# Altium schematic sheet design_13.SchDoc: design
size 414 x 279 mm; Date: 1/25/2021 11:39:22 PM; SheetNumber: 14; Origin: Eagle; GateName_1: G$1; SymbolName_1: A3-L-GUMSTIX; LibraryName: qualified_1; DeviceSetName: A3-L-GUMSTIX; A: A; B: B; C: C; D: D; E: E; F: F; G: G; H: H; 1: 1; 2: 2; 3: 3; 4: 4; 5: 5; Sheet: Sheet:; C:/Gumstix/gumstix-logo-16.bmp: C:/Gumstix/gumstix-logo-16.bmp; Board: Board:
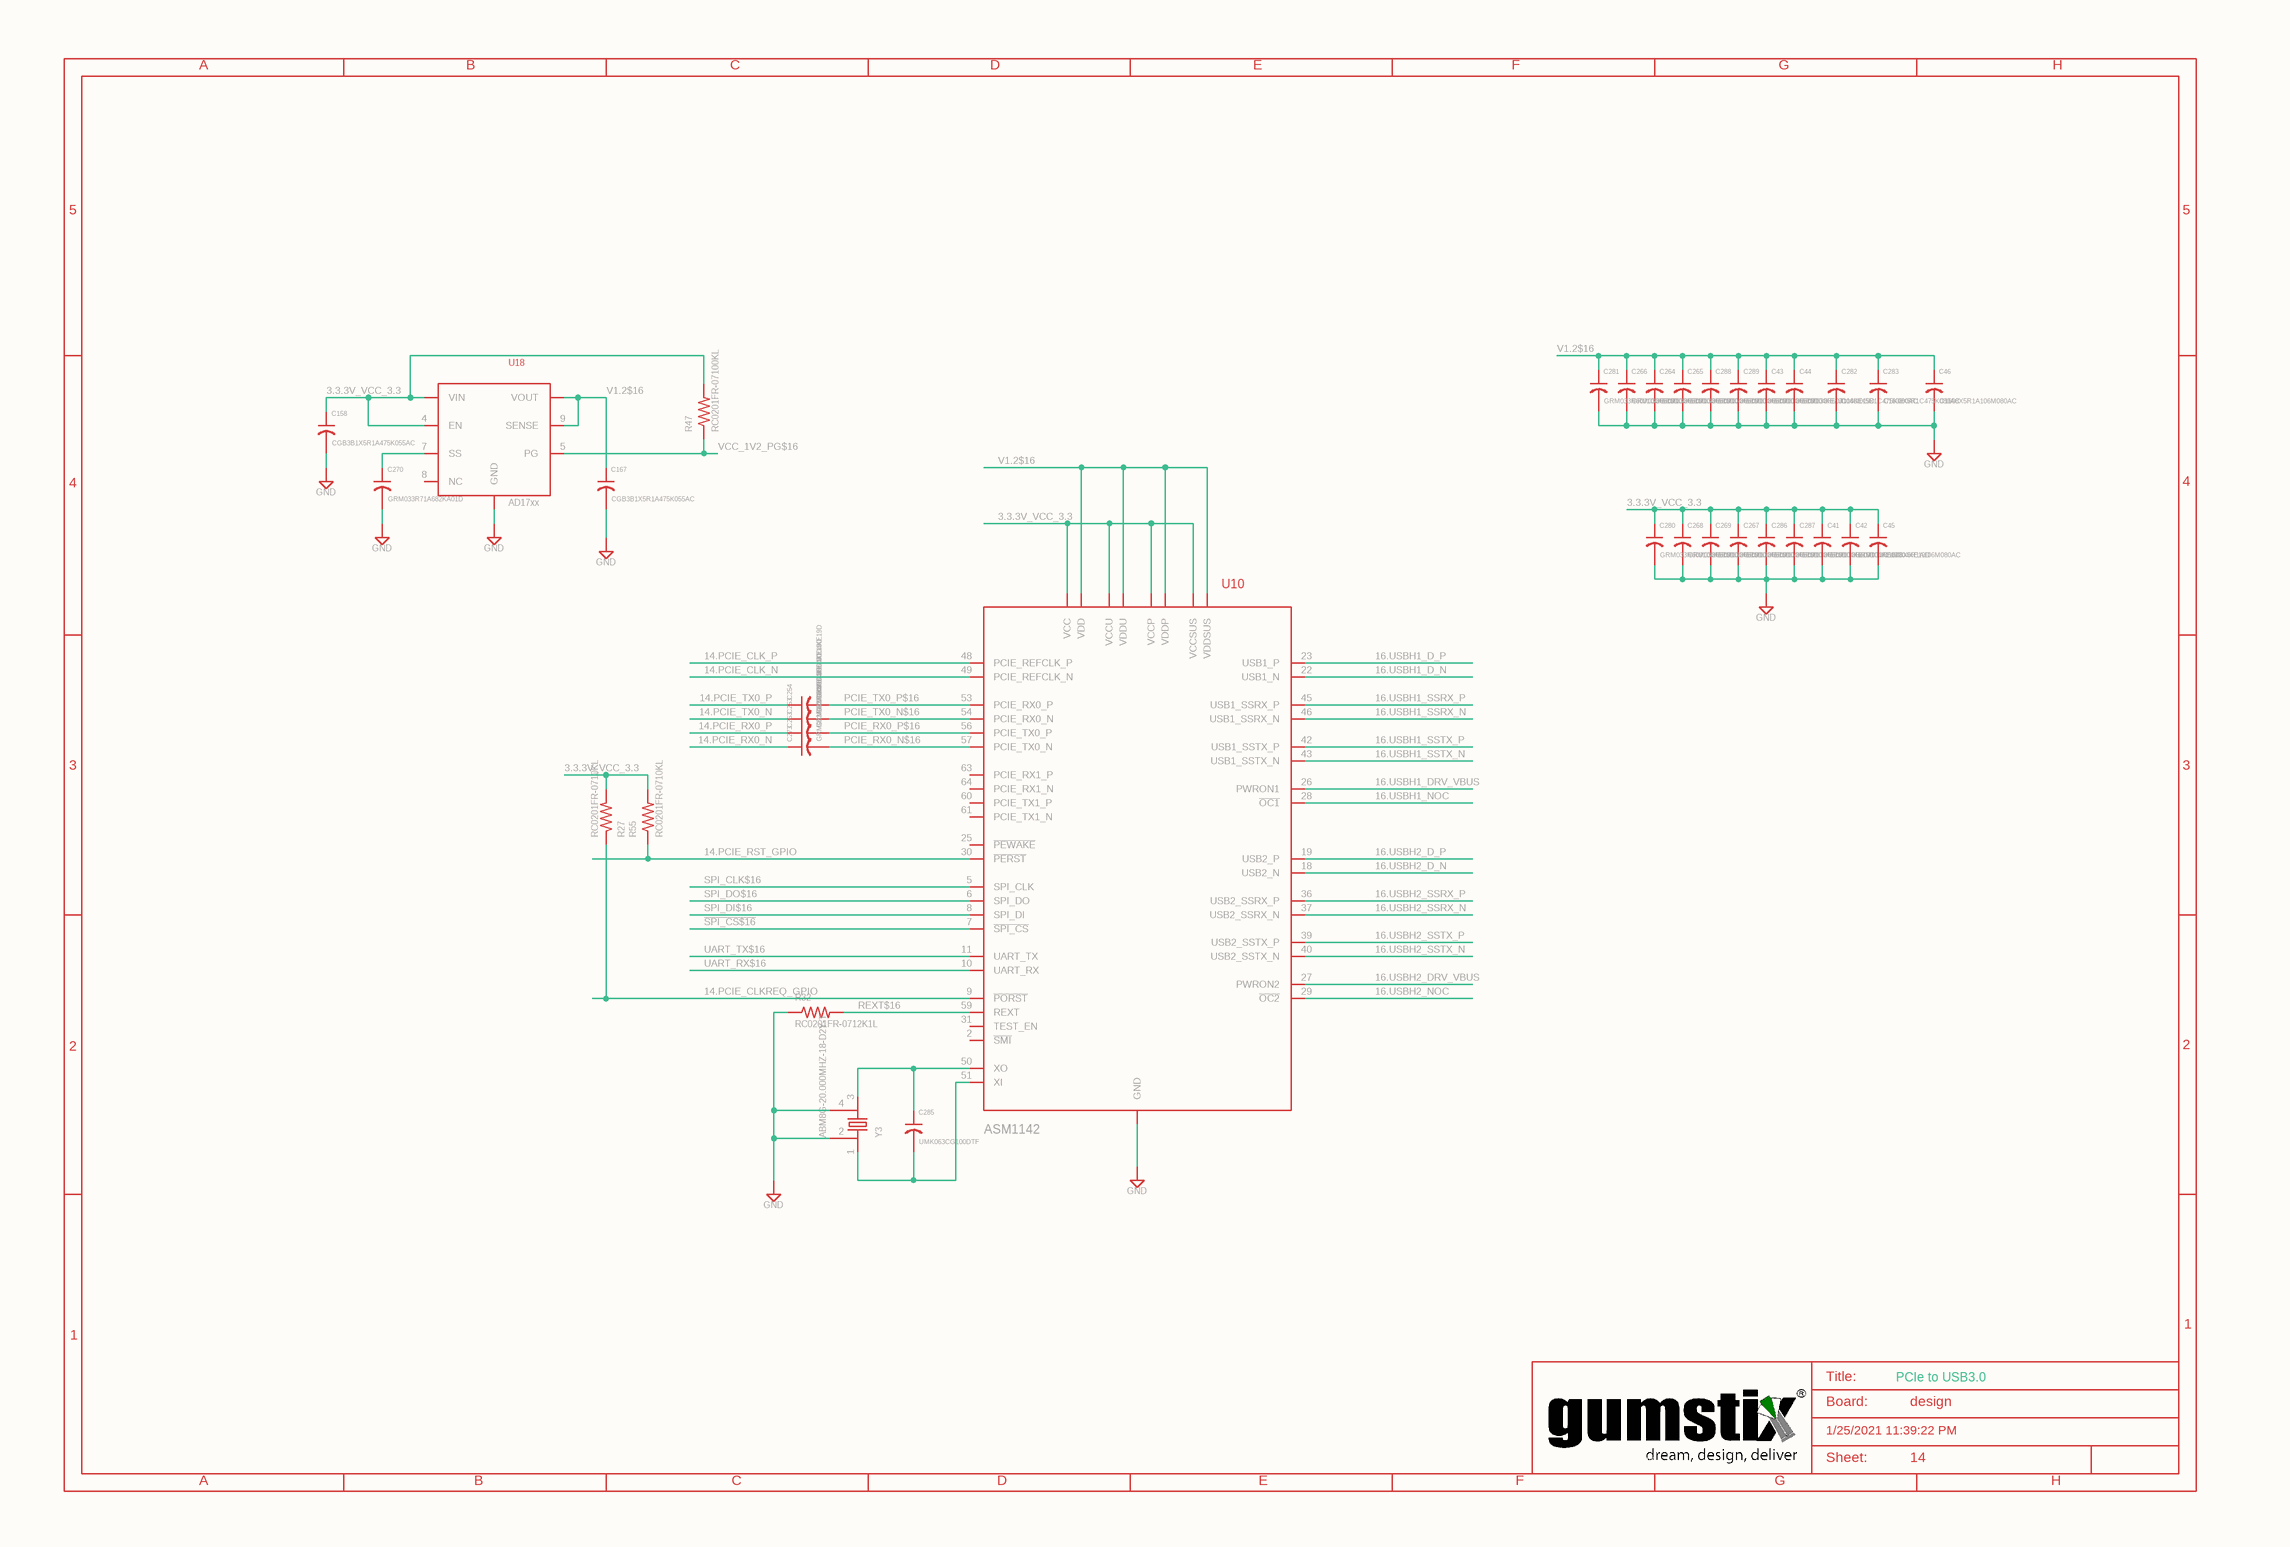
[diagram p0: design_13.SchDoc]

## Parts
C41  GRM033R60J104KE19D  [0201]
C42  GRM033R60J104KE19D  [0201]
C43  GRM033R60J104KE19D  [0201]
C44  GRM033R60J104KE19D  [0201]
C45  C1608X5R1A106M080AC  [0603]
C46  C1608X5R1A106M080AC  [0603]
C158  CGB3B1X5R1A475K055AC  [0603]
C167  CGB3B1X5R1A475K055AC  [0603]
C253  GRM033R60J104KE19D  [0201]
C254  GRM033R60J104KE19D  [0201]
C263  GRM033R60J104KE19D  [0201]
C264  GRM033R60J104KE19D  [0201]
C265  GRM033R60J104KE19D  [0201]
C266  GRM033R60J104KE19D  [0201]
C267  GRM033R60J104KE19D  [0201]
C268  GRM033R60J104KE19D  [0201]
C269  GRM033R60J104KE19D  [0201]
C270  GRM033R71A682KA01D  [0201]
C273  GRM033R60J104KE19D  [0201]
C280  GRM033R60J104KE19D  [0201]
C281  GRM033R60J104KE19D  [0201]
C282  C1608X5R1C475K080AC  [0603]
C283  C1608X5R1C475K080AC  [0603]
C285  UMK063CG100DTF  [0201]
C286  GRM033R60J104KE19D  [0201]
C287  GRM033R60J104KE19D  [0201]
C288  GRM033R60J104KE19D  [0201]
C289  GRM033R60J104KE19D  [0201]
R27  RC0201FR-0710KL  [0201]
R32  RC0201FR-0712K1L  [0201]
R47  RC0201FR-07100KL  [0201]
R55  RC0201FR-0710KL  [0201]
SUPPLY84  GND
SUPPLY87  GND
SUPPLY99  GND
SUPPLY141  GND
SUPPLY162  GND
SUPPLY163  GND
SUPPLY164  GND
SUPPLY165  GND
U10  ASM1142  [QFN64-9X9MM-FT2232HQ]
U18  ADP1740ACPZ-1.2-R7  [LFCSPWQ16]  (value not drawn)
Y3  ABM8G-20.000MHZ-18-D2Y-T  [CRYSTAL-3225]

## Nets
3.3.3V_VCC_3.3: C41.1 C42.1 C45.1 C158.1 C267.1 C268.1 C269.1 C280.1 C286.1 C287.1 R27.2 R47.2 R55.2 U10.4_32(VCC) U10.20_24(VCCSUS) U10.38_44(VCCU) U10.55_62(VCCP) U18.1_2_3_15_16(VIN) U18.4(EN)
14.PCIE_CLK_N: U10.49(PCIE_REFCLK_N)
14.PCIE_CLK_P: U10.48(PCIE_REFCLK_P)
14.PCIE_CLKREQ_GPIO: R27.1 U10.9(~{PORST})
14.PCIE_RST_GPIO: R55.1 U10.30(~{PERST})
14.PCIE_RX0_N: C273.1
14.PCIE_RX0_P: C263.1
14.PCIE_TX0_N: C253.1
14.PCIE_TX0_P: C254.1
16.USBH1_D_N: U10.22(USB1_N)
16.USBH1_D_P: U10.23(USB1_P)
16.USBH1_DRV_VBUS: U10.26(PWRON1)
16.USBH1_NOC: U10.28(~{OC1})
16.USBH1_SSRX_N: U10.46(USB1_SSRX_N)
16.USBH1_SSRX_P: U10.45(USB1_SSRX_P)
16.USBH1_SSTX_N: U10.43(USB1_SSTX_N)
16.USBH1_SSTX_P: U10.42(USB1_SSTX_P)
16.USBH2_D_N: U10.18(USB2_N)
16.USBH2_D_P: U10.19(USB2_P)
16.USBH2_DRV_VBUS: U10.27(PWRON2)
16.USBH2_NOC: U10.29(~{OC2})
16.USBH2_SSRX_N: U10.37(USB2_SSRX_N)
16.USBH2_SSRX_P: U10.36(USB2_SSRX_P)
16.USBH2_SSTX_N: U10.40(USB2_SSTX_N)
16.USBH2_SSTX_P: U10.39(USB2_SSTX_P)
PCIE_RX0_N$16: C273.2 U10.57(PCIE_TX0_N)
PCIE_RX0_P$16: C263.2 U10.56(PCIE_TX0_P)
PCIE_TX0_N$16: C253.2 U10.54(PCIE_RX0_N)
PCIE_TX0_P$16: C254.2 U10.53(PCIE_RX0_P)
REXT$16: R32.2 U10.59(REXT)
~{SPI_CS$16}: U10.7(~{SPI_CS})
SPI_CLK$16: U10.5(SPI_CLK)
SPI_DI$16: U10.8(SPI_DI)
SPI_DO$16: U10.6(SPI_DO)
UART_RX$16: U10.10(UART_RX)
UART_TX$16: U10.11(UART_TX)
V1.2$16: C43.1 C44.1 C46.1 C167.1 C264.1 C265.1 C266.1 C281.1 C282.1 C283.1 C288.1 C289.1 U10.1_12_33(VDD) U10.21_34(VDDSUS) U10.35_41_47(VDDU) U10.52_58(VDDP) U18.9(SENSE) U18.10_11_12_13_14(VOUT)
VCC_1V2_PG$16: R47.1 U18.5(PG)
NetC41_2: C41.2 C42.2 C45.2 C267.2 C268.2 C269.2 C280.2 C286.2 C287.2 SUPPLY164.?1(GND)
NetC43_2: C43.2 C44.2 C46.2 C264.2 C265.2 C266.2 C281.2 C282.2 C283.2 C288.2 C289.2 SUPPLY165.?1(GND)
NetC158_2: C158.2 SUPPLY84.?1(GND)
NetC167_2: C167.2 SUPPLY87.?1(GND)
NetC270_1: C270.1 U18.7(SS)
NetC270_2: C270.2 SUPPLY141.?1(GND)
NetC285_1: C285.1 U10.50(XO) Y3.3
NetC285_2: C285.2 U10.51(XI) Y3.1
NetR32_1: R32.1 SUPPLY163.?1(GND) Y3.2 Y3.4
NetSUPPLY99_?1: SUPPLY99.?1(GND) U18.6_EP_EP1_EP2_EP3_EP4(GND)
NetSUPPLY162_?1: SUPPLY162.?1(GND) U10.15_65_EPAD1_EPAD2_EPAD3_EPAD4_EPAD5_EPAD6_EPAD7_EPAD8_EPAD9_EPAD10_EPAD11_EPAD12(GND)

Not connected (* = marked no-connect by the designer): U10 2(~{SMI}) 25(~{PEWAKE}) 31(TEST_EN) 60(PCIE_TX1_P) 61(PCIE_TX1_N) 63(PCIE_RX1_P) 64(PCIE_RX1_N); U18 8(NC)

## Notes on the sheet
- A
- B
- C
- D
- E
- F
- G
- H
- 5
- 4
- 3
- 2
- 1
- Title:
- Board:
- PCIe to USB3.0
- design
- C:/Gumstix/gumstix-logo-16.bmp
- 1/25/2021 11:39:22 PM
- Sheet:
- 14

## Library data of the parts
C41-C44 C253 C254 C263-C269 C273 C280 C281 C286-C289 = GRM033R60J104KE19D: GateName_1: G$1; SymbolName_1: C-US; LibraryName: qualified_1@eagle_src_repo_701dee95a4f0c9d27f896634bd535ea9ef5a137e; DeviceSetName: GRM033R60J104KE19D; HEIGHT: 0.25
C45 C46 = C1608X5R1A106M080AC: GateName_1: G$1; SymbolName_1: C-US; LibraryName: qualified_1@eagle_src_repo_701dee95a4f0c9d27f896634bd535ea9ef5a137e; DeviceSetName: C1608X5R1A106M080AC; HEIGHT: 0.5
C158 C167 = CGB3B1X5R1A475K055AC: GateName_1: G$1; SymbolName_1: C-US; LibraryName: qualified_1@eagle_src_repo_701dee95a4f0c9d27f896634bd535ea9ef5a137e; DeviceSetName: CGB3B1X5R1A475K055AC; HEIGHT: 0.5
C270 = GRM033R71A682KA01D: GateName_1: G$1; SymbolName_1: C-US; LibraryName: qualified_1@eagle_src_repo_701dee95a4f0c9d27f896634bd535ea9ef5a137e; DeviceSetName: GRM033R71A682KA01D; HEIGHT: 0.25
C282 C283 = C1608X5R1C475K080AC: GateName_1: G$1; SymbolName_1: C-US; LibraryName: qualified_1@eagle_src_repo_701dee95a4f0c9d27f896634bd535ea9ef5a137e; DeviceSetName: C1608X5R1C475K080AC; HEIGHT: 0.5
C285 = UMK063CG100DTF: GateName_1: G$1; SymbolName_1: C-US; LibraryName: qualified_1@eagle_src_repo_701dee95a4f0c9d27f896634bd535ea9ef5a137e; DeviceSetName: UMK063CG100DTF; HEIGHT: 0.25
R27 R55 = RC0201FR-0710KL: GateName_1: G$1; SymbolName_1: R-US; LibraryName: qualified_1; DeviceSetName: RC0201FR-0710KL; HEIGHT: 0.25
R32 = RC0201FR-0712K1L: GateName_1: G$1; SymbolName_1: R-US; LibraryName: qualified_1; DeviceSetName: RC0201FR-0712K1L; HEIGHT: 0.25
R47 = RC0201FR-07100KL: GateName_1: G$1; SymbolName_1: R-US; LibraryName: qualified_1; DeviceSetName: RC0201FR-07100KL; HEIGHT: 0.25
SUPPLY84 SUPPLY87 SUPPLY99 SUPPLY141 SUPPLY162-SUPPLY165 = GND: SUPPLY SYMBOL; SymbolName_1: GND-2; GateName_1: GND; LibraryName: qualified_1; DeviceSetName: GND
U10 = ASM1142: ASM1142    PCI Express to 2 ports SuperSpeed USB 10Gbps xHCI Host Controller; GateName_1: G$1; SymbolName_1: ASM1142; LibraryName: qualified_1; DeviceSetName: ASM1142
U18 = ADP1740ACPZ-1.2-R7: ADP1740 series of fixed voltage LDO. Max 2A output at 0.75, 1, 1.1, 1.2, 1.3, 1.5, 1.8, 2.5V; GateName_1: G$1; SymbolName_1: AD17XXFIXED; LibraryName: qualified_1; DeviceSetName: ADP1740ACPZ-1.2-R7; AD17xx: AD17xx
Y3 = ABM8G-20.000MHZ-18-D2Y-T: GateName_1: G$1; SymbolName_1: Y4; LibraryName: qualified_1; DeviceSetName: ABM8G-20.000MHZ-18-D2Y-T; 1: 1; 3: 3; HEIGHT: 0.8